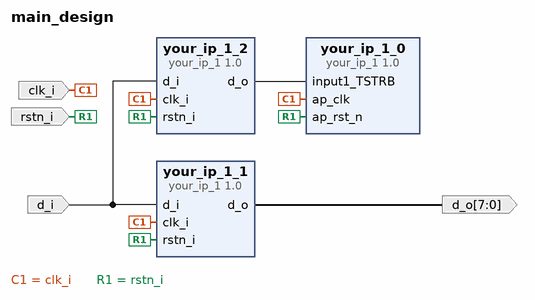
[diagram p0: block diagram of the top level]
# Vivado block design main_design, xczu9eg-ffvc900-1-i-es1, Vivado 2016.3
create_bd_design main_design

create_bd_port -dir I -type clk clk_i
create_bd_port -dir I -type rst rstn_i
set_property -dict {CONFIG.POLARITY ACTIVE_LOW} [get_bd_ports rstn_i]
create_bd_port -dir I d_i
create_bd_port -dir O -from 7 -to 0 d_o

create_bd_cell -type ip -vlnv xilinx.com:hls:your_ip_1:1.0 your_ip_1_0
create_bd_cell -type ip -vlnv xilinx.com:user:your_ip_1:1.0 your_ip_1_1
create_bd_cell -type ip -vlnv xilinx.com:user:your_ip_1:1.0 your_ip_1_2

# ---- connections ----

connect_bd_net [get_bd_ports clk_i] [get_bd_pins your_ip_1_0/ap_clk] [get_bd_pins your_ip_1_1/clk_i] [get_bd_pins your_ip_1_2/clk_i]
connect_bd_net [get_bd_ports rstn_i] [get_bd_pins your_ip_1_0/ap_rst_n] [get_bd_pins your_ip_1_1/rstn_i] [get_bd_pins your_ip_1_2/rstn_i]
connect_bd_net [get_bd_ports d_i] [get_bd_pins your_ip_1_1/d_i] [get_bd_pins your_ip_1_2/d_i]
connect_bd_net [get_bd_pins your_ip_1_1/d_o] [get_bd_ports d_o]
connect_bd_net [get_bd_pins your_ip_1_2/d_o] [get_bd_pins your_ip_1_0/input1_TSTRB]

validate_bd_design
save_bd_design
